# Altium schematic sheet ATMEGA162_rev2.SchDoc
size A4
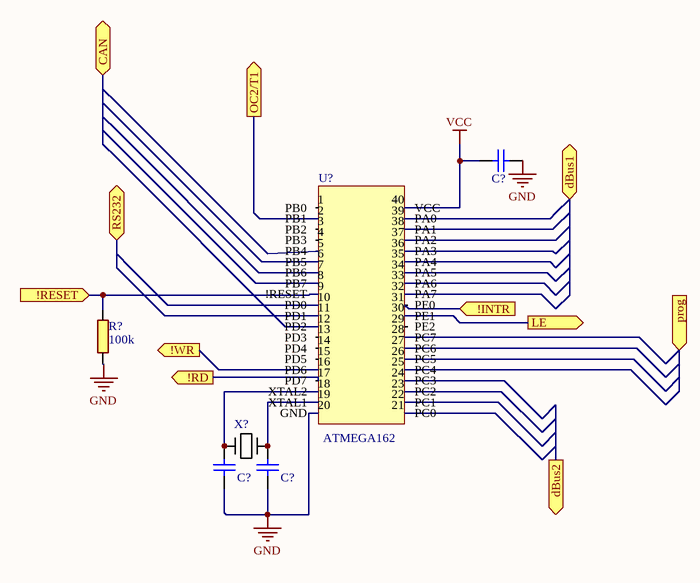
[diagram p0: ATMEGA162_rev2.SchDoc]

## Parts
(Parts that share a designator on the sheet are numbered #1, #2 ... from top to bottom, then left to right.)
C?#1  0603 Cap  [0603 Capacitor]  (value not drawn)
C?#2  0603 Cap  [0603 Capacitor]  (value not drawn)
C?#3  0603 Cap  [0603 Capacitor]  (value not drawn)
R?  100k  [RESC0603(1608)_N]
U?  ATMEGA162  [PCBComponent_1]
X?  ABM3-16.000MHZ-D2Y-T  [CRYSTAL-ABM7]  (value not drawn)

## Ports
!INTR (in), !RD (out), !RESET (in), !WR (out), CAN (bidir), dBus1 (bidir), dBus2 (out), LE (out), OC2/T1 (out), prog (in), RS232 (bidir)

## Nets
GND: C?#1.1 C?#2.2 C?#3.2 R?.1 U?.20(GND)
VCC: C?#1.2 U?.40(VCC)
!INTR: U?.31(PE0) ; port !INTR
!RD: U?.17(PD7) ; port !RD
!RESET: R?.2 U?.9(!RESET) ; port !RESET
!WR: U?.16(PD6) ; port !WR
LE: U?.30(PE1) ; port LE
OC2/T1: U?.2(PB1) ; port OC2/T1
NetC?#2_1: C?#2.1 U?.18(XTAL2) X?.1
NetC?#3_1: C?#3.1 U?.19(XTAL1) X?.2

Not connected (* = marked no-connect by the designer): U? 1(PB0) 3(PB2) 4(PB3) 5(PB4) 6(PB5) 7(PB6) 8(PB7) 10(PD0) 11(PD1) 12(PD2) 13(PD3) 14(PD4) 15(PD5) 21(PC0) 22(PC1) 23(PC2) 24(PC3) 25(PC4) 26(PC5) 27(PC6) 28(PC7) 29(PE2) 32(PA7) 33(PA6) 34(PA5) 35(PA4) 36(PA3) 37(PA2) 38(PA1) 39(PA0)

## Library data of the parts
C?#1-C?#3 = CMP-001-A20-6: value: *
R? = 2384: 0.1W 1% Thick film resistor; id: 2384; rad: -1; rom: OV; lager_type: Fremlager; dybde: 96; hylle: 2; antall: 100; kolonne: 0; pakke_opprettet_av: 815; pakketype: 0603; pakke_opprettet: 08.07.2014 21:15:30; symbol_opprettet_av: 815; symbol_opprettet: 08.07.2014 21:16:33; navn: 100k; pris: 0; nokkelord: Resistor
U? = Component_1: AVR ATMEGA162
X? = 4474: id: 4474; rad: 2; rom: OV; lager_type: Fremlager; dybde: 4; hylle: 7; antall: 10; pakke_opprettet_av: 774; beskrivelse: Krystall 16MHz 18pF, 5*3.2,  ABM3, 30ppm; leverandor_varenr: 2467791; nokkelord: Krystall 16MHz 18pF  ABM3,30ppm 16 MHz; leverandor: Farnell; pakketype: SMD; pakke_opprettet: 23.08.2014 20:10:40; symbol_opprettet_av: 774; symbol_opprettet: 23.08.2014 20:23:20; navn: ABM3-16.000MHZ-D2Y-T; pris: 10